# Altium schematic sheet MCU.SchDoc
size A4
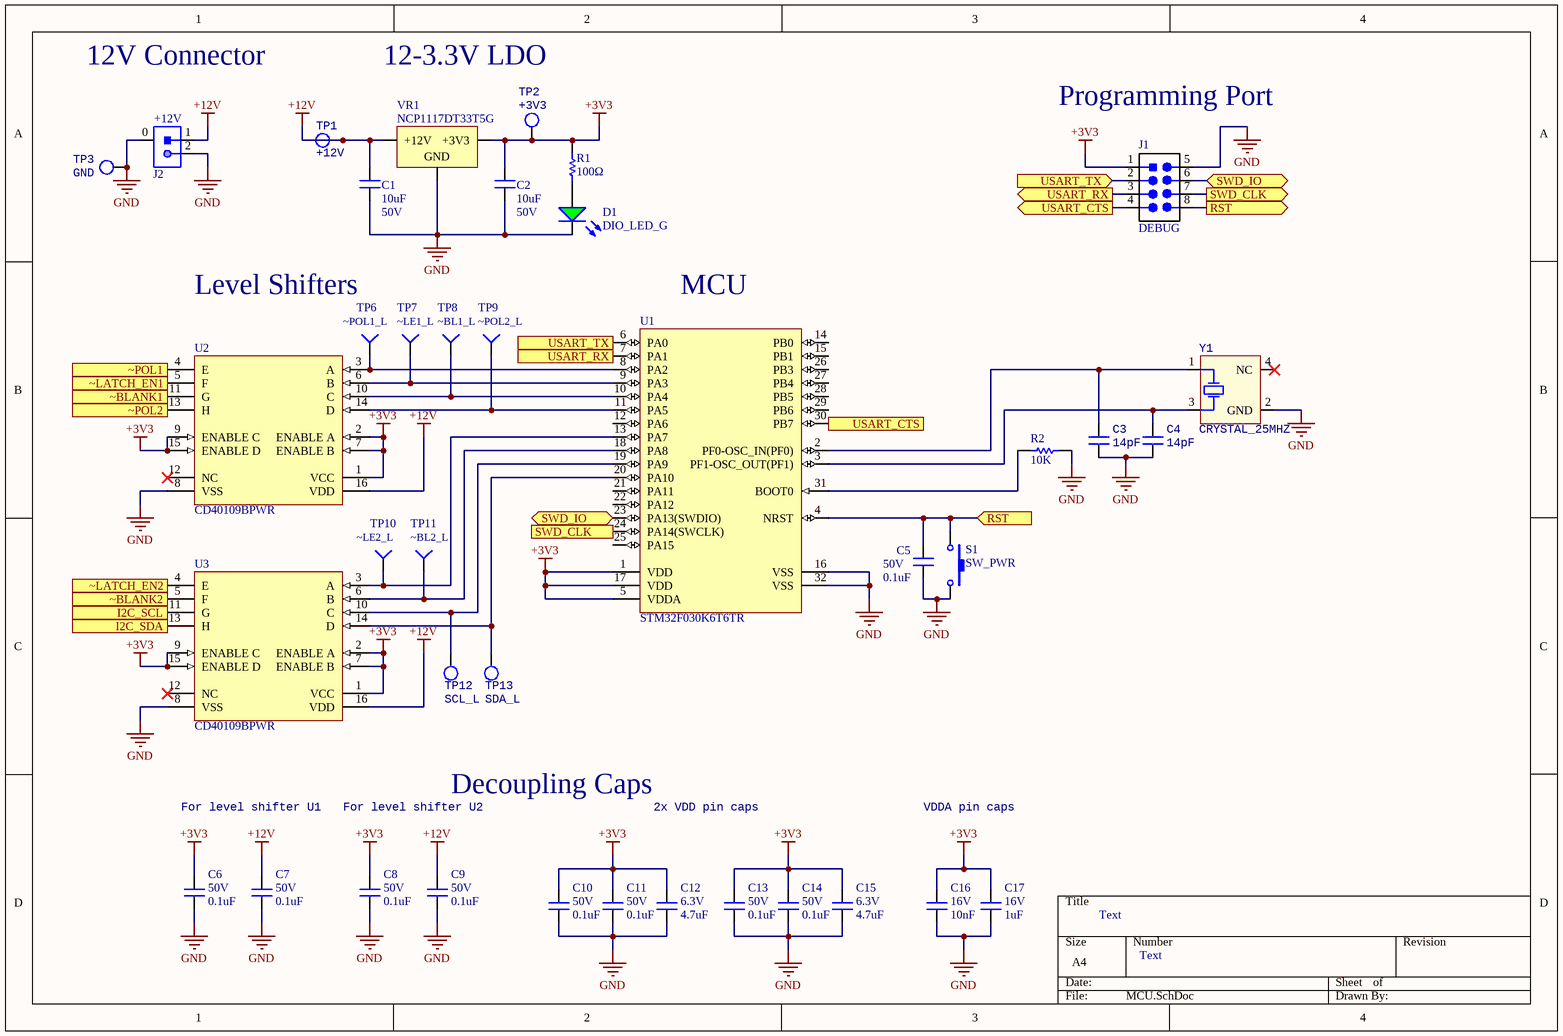
[diagram p0: MCU.SchDoc]

## Parts
C1  Voltage Rating: 50V  [CAPC1206(3216)]  (hidden comment: 10uF)
C2  Voltage Rating: 50V  [CAPC1206(3216)]  (hidden comment: 10uF)
C3  value 14pF  [CAPC0603(1608)55_N]  (hidden comment: CAP_14pF_50V_0603)
C4  value 14pF  (hidden comment: *)
C5  value 0.1uF  Voltage Rating: 50V  [CAPC0603(1608)55_N]  (hidden comment: CAP_0.1uF_50V_0603)
C6  value 0.1uF  Voltage Rating: 50V  [CAPC0603(1608)55_N]  (hidden comment: CAP_0.1uF_50V_0603)
C7  value 0.1uF  Voltage Rating: 50V  [CAPC0603(1608)55_N]  (hidden comment: CAP_0.1uF_50V_0603)
C8  value 0.1uF  Voltage Rating: 50V  [CAPC0603(1608)55_N]  (hidden comment: CAP_0.1uF_50V_0603)
C9  value 0.1uF  Voltage Rating: 50V  [CAPC0603(1608)55_N]  (hidden comment: CAP_0.1uF_50V_0603)
C10  value 0.1uF  Voltage Rating: 50V  [CAPC0603(1608)55_N]  (hidden comment: CAP_0.1uF_50V_0603)
C11  value 0.1uF  Voltage Rating: 50V  [CAPC0603(1608)55_N]  (hidden comment: CAP_0.1uF_50V_0603)
C12  value 4.7uF  Voltage Rating: 6.3V  [CAPC0603(1608)55_N]  (hidden comment: CAP_4.7uF_0603)
C13  value 0.1uF  Voltage Rating: 50V  [CAPC0603(1608)55_N]  (hidden comment: CAP_0.1uF_50V_0603)
C14  value 0.1uF  Voltage Rating: 50V  [CAPC0603(1608)55_N]  (hidden comment: CAP_0.1uF_50V_0603)
C15  value 4.7uF  Voltage Rating: 6.3V  [CAPC0603(1608)55_N]  (hidden comment: CAP_4.7uF_0603)
C16  value 10nF  Voltage Rating: 16V  [CAPC0603(1608)55_N]  (hidden comment: CAP_10nF_0603)
C17  value 1uF  Voltage Rating: 16V  [CAPC0603(1608)55_N]  (hidden comment: CAP_1uF_16V_0603)
D1  DIO_LED_G  [LED_0805_LINE]
J1  DEBUG  [HEADER_2X4]
J2  +12V  [MOLEX-5024940270]
R1  value 100Ω  [RESC0603(1608)_N]  (hidden comment: RES_100Ω_0603)
R2  value 10K  [RESC0603(1608)_N]  (hidden comment: RES_10K_0603)
S1  SW_PWR  [PTS830GM140]
TP1  +12V  [TESTPOINT_LOOP]
TP2  +3V3  [TESTPOINT_LOOP]
TP3  GND  [TESTPOINT_LOOP]
TP6  ~POL1_L  [TESTPOINT]
TP7  ~LE1_L  [TESTPOINT]
TP8  ~BL1_L  [TESTPOINT]
TP9  ~POL2_L  [TESTPOINT]
TP10  ~LE2_L  [TESTPOINT]
TP11  ~BL2_L  [TESTPOINT]
TP12  SCL_L  [TESTPOINT_LOOP]
TP13  SDA_L  [TESTPOINT_LOOP]
U1  STM32F030K6T6TR  [STM-LQFP32_M]
U2  CD40109BPWR  [LVL_SHIFTER_PW0016A_M]
U3  CD40109BPWR  [LVL_SHIFTER_PW0016A_M]
VR1  NCP1117DT33T5G  [VOLTAGE_REGULATOR]
Y1  CRYSTAL_25MHZ  [AVX-CX2520DB32000D0GEJZ1-4_V]

## Ports
I2C_SCL (out), I2C_SDA (out), RST (in), RST (out), SWD_CLK (in), SWD_CLK (out), SWD_IO (bidir), USART_CTS (in), USART_CTS (out), USART_RX (in), USART_RX (out), USART_TX (in), USART_TX (out), ~BLANK1 (out), ~BLANK2 (out), ~LATCH_EN1 (out), ~LATCH_EN2 (out), ~POL1 (out), ~POL2 (out)

## Nets
+3V3: C2.1 C6.2 C8.2 C10.2 C11.2 C12.2 C13.2 C14.2 C15.2 C16.2 C17.2 J1.1(VCC) R1.1 TP2.1 U1.1(VDD) U1.5(VDDA) U1.17(VDD) U2.1(VCC) U2.2(ENABLE_A) U2.7(ENABLE_B) U2.9(ENABLE_C) U2.15(ENABLE_D) U3.1(VCC) U3.2(ENABLE_A) U3.7(ENABLE_B) U3.9(ENABLE_C) U3.15(ENABLE_D) VR1.2(+3V3)
+12V: C1.1 C7.2 C9.2 J2.1 TP1.1 U2.16(VDD) U3.16(VDD) VR1.3(+12V)
GND: C1.2 C2.2 C3.1 C4.1 C5.1 C6.1 C7.1 C8.1 C9.1 C10.1 C11.1 C12.1 C13.1 C14.1 C15.1 C16.1 C17.1 D1.2(K) J1.5(GND) J2.0 J2.2 R2.2 S1.2 TP3.1 U1.16(VSS) U1.32(VSS) U2.8(VSS) U3.8(VSS) VR1.1(GND) Y1.2(GND)
I2C_SCL: U3.11(G) ; port I2C_SCL
I2C_SDA: U3.13(H) ; port I2C_SDA
RST: C5.2 J1.8 S1.1 U1.4(NRST) ; port RST
SWD_CLK: J1.7 U1.24(PA14(SWCLK)) ; port SWD_CLK
SWD_IO: J1.6 U1.23(PA13(SWDIO)) ; port SWD_IO
USART_CTS: J1.4 U1.30(PB7) ; port USART_CTS
USART_RX: J1.3 U1.7(PA1) ; port USART_RX
USART_TX: J1.2 U1.6(PA0) ; port USART_TX
~BLANK1: U2.11(G) ; port ~BLANK1
~BLANK2: U3.5(F) ; port ~BLANK2
~LATCH_EN1: U2.5(F) ; port ~LATCH_EN1
~LATCH_EN2: U3.4(E) ; port ~LATCH_EN2
~POL1: U2.4(E) ; port ~POL1
~POL2: U2.13(H) ; port ~POL2
NetC3_2: C3.2 U1.2(PF0-OSC_IN(PF0)) Y1.1(HOT)
NetC4_2: C4.2 U1.3(PF1-OSC_OUT(PF1)) Y1.3(HOT)
NetD1_1: D1.1(A) R1.2
NetR2_1: R2.1 U1.31(BOOT0)
NetTP6_1: TP6.1(=value) U1.8(PA2) U2.3(A)
NetTP7_1: TP7.1(=value) U1.9(PA3) U2.6(B)
NetTP8_1: TP8.1(=value) U1.10(PA4) U2.10(C)
NetTP9_1: TP9.1(=value) U1.11(PA5) U2.14(D)
NetTP10_1: TP10.1(=value) U1.13(PA7) U3.3(A)
NetTP11_1: TP11.1(=value) U1.18(PA8) U3.6(B)
NetTP12_1: TP12.1 U1.19(PA9) U3.10(C)
NetTP13_1: TP13.1 U1.20(PA10) U3.14(D)

Not connected (* = marked no-connect by the designer): U1 12(PA6) 14(PB0) 15(PB1) 21(PA11) 22(PA12) 25(PA15) 26(PB3) 27(PB4) 28(PB5) 29(PB6); U2 12(NC)*; U3 12(NC)*; Y1 4(NC)*

## Notes on the sheet
- 12V Connector
- 12-3.3V LDO
- Programming Port
- Level Shifters
- (near U1) MCU
- For level shifter U1
- For level shifter U2
- Decoupling Caps
- 2x VDD pin caps
- VDDA pin caps
- Text

## Library data of the parts
C1 C2 = CAP_10uF_50V_1206: CAP CER 10UF 50V X5R 1206; Manufacturer Part Numer 1: GRT31CR61H106KE01L; Manufacturer 1: Murata; Dimensions: 0.126" L x 0.063" W (3.20mm x 1.6mm); Package: 1206 (3216 Metric); Supplier Part Number 1: 490-12456-1-ND; Supplier 1: Digi-Key; Mount: Surface Mount; Value: 10uF
C3 C4 = CAP_14pF_50V_0603: CAP CER 14PF 50V C0G/NP0 0603; Manufacturer 1: Samsung; Manufacturer Part Number 1: CL10C140JB8NNNC; Tolerance: 5%; Dielectric: C0G; Supplier 1: Digi-Key; Stock 1: 187088; Pricing 1: 1=0.10000, 10=0.06700, 100=0.02980, 500=0.02130, 1000=0.01673 (USD); RoHS: Yes; Mount: Surface Mount; Case/Package: 0603; Case Code (Metric): 1608; Case Code (Imperial): 0603; Min Operating Temperature: -55°C; Max Operating Temperature: 125°C; Package Quantity: 1; Packaging: Tape and Reel; Voltage Rating: 50V; Voltage Rating (DC): 50V; Length: 1.6mm; Height: 0.8mm; Width: 0.031inch; Depth: 0.8mm; Thickness: 0.035inch; Radiation Hardening: No; ComponentLink1URL: https://datasheet.ciiva.com/25782/cl10c140jb8nnnc-25782947.pdf?src-supplier=Digi-Key; ComponentLink1Description: https://datasheet.ciiva.com/25782/cl10c140jb8nnnc-25782947.pdf?src-supplier=Digi-Key; Supplier Part Number 1: 1276-2187-1-ND; Capacitance: 14pF
C5-C11 C13 C14 = CAP_0.1uF_50V_0603: CAP CER 0.1UF 50V X7R 0603; Manufacturer Part Number 1: CC0603KRX7R9BB104; Manufacturer 1: Yageo; Dimensions: 0.063" L x 0.031" W (1.60mm x 0.80mm); Package: 0603 (1608 Metric); Temperature Coefficient: X7R; Supplier Part Number 1: 311-1344-1-ND; Supplier 1: Digi-Key; Mount: Surface Mount
C12 C15 = CAP_4.7uF_0603: CAP CER 4.7UF 6.3V X5R 0603; Manufacturer Part Number 1: CC0603KRX5R5BB475; Manufacturer 1: Yageo; Dimensions: 0.063" L x 0.031" W (1.60mm x 0.80mm); Package: 0603 (1608 Metric); Temperature Coefficient: X5R; Supplier Part Number 1: 311-1521-1-ND; Supplier 1: Digi-Key; Mount: Surface Mount
C16 = CAP_10nF_0603: CAP CER 10000PF 16V X7R 0603; Manufacturer Part Number 1: CC0603KRX7R7BB103; Manufacturer 1: Yageo; Dimensions: 0.063" L x 0.031" W (1.60mm x 0.80mm); Package: 0603 (1608 Metric); Temperature Coefficient: X7R; Supplier Part Number 1: 311-3369-1-ND; Supplier 1: Digi-Key; Mount: Surface Mount
C17 = CAP_1uF_16V_0603: CAP CER 1UF 16V Y5V 0603; Manufacturer Part Number: CC0603ZRY5V7BB105; Manufacturer 1: Yageo; Dimensions: 0.063" L x 0.031" W (1.60mm x 0.80mm); Package: 0603 (1608 Metric); Temperature Coefficient: Y5V; Supplier Part Number 1: 311-1372-1-ND; Supplier 1: Digi-Key; Mount: Surface Mount
D1 = DIO_LED_G: LED GREEN DIFFUSED 0805 SMD; Manufacturer Part Number 1: LG R971-KN-1; Manufacturer 1: OSRAM; Forward Voltage Drop: 2.2V; Package: 0805 (2012 Metric); Supplier Part Number 1: 475-1410-1-ND; Supplier 1: Digi-Key; Mount: Surface Mount
J1 = HEADER 4X2: CONN HEADER VERT 8POS 2.54MM; Manufacturer Part Number 1: M20-9980445; Manufacturer 1: Harwin Inc.; Supplier Part Number 1: 952-2122-ND; Supplier 1: Digi-Key; Mount: Through Hole
J2 = CON_2M_SM_RA: CONN HEADER SMD RIGHT ANGLE 2MM PITCH; Manufacturer 1: Molex; Manufacturer Part Number 1: 5024940270; Connector Type: Receptacle,Forked; Number of Positions: 2; Supplier 1: Digi-Key; Stock 1: 3397; Pricing 1: 1=0.53000, 10=0.49400, 25=0.44440, 50=0.39500, 100=0.37850, 250=0.34556 (USD); RoHS: No; Mount: Surface Mount; Contact Plating: Tin; Insulation Color: Natural; Insulation Material: Resin; Min Operating Temperature: -40°C; Max Operating Temperature: 105°C; Fastening Type: Latch; Packaging: Tape and Reel; Number of Rows: 1; Termination: Solder; Flammability Rating: UL94 V-0; ComponentLink1URL: https://www.molex.com/pdm_docs/as/AS-502439-002-001.pdf?src-supplier=Digi-Key; ComponentLink1Description: https://www.molex.com/pdm_docs/as/AS-502439-002-001.pdf?src-supplier=Digi-Key; Supplier Part Number 1: WM15810CT-ND
R1 = RES_100Ω_0603: RES SMD 100 OHM 1% 1/10W 0603; Manufacturer 1: Yageo; Manufacturer Part Number 1: RC0603FR-07100RL; Package: 0603 (1608 Metric); Dimensions: 0.063" L x 0.031" W (1.60mm x 0.80mm); Tolerance: 1%; Supplier Part Number 1: 311-100HRCT-ND; Supplier 1: Digi-Key; Mount: Surface Mount
R2 = RES_10K_0603: RES SMD 10K OHM 5% 1/10W 0603; Manufacturer 1: Yageo; Manufacturer Part Number 1: RC0603JR-0710KL; Package: 0603 (1608 Metric); Dimensions: 0.063" L x 0.031" W (1.60mm x 0.80mm); Tolerance: 5%; Supplier Part Number 1: 311-10KGRCT-ND; Supplier 1: Digi-Key; Mount: Surface Mount
S1 = SW_PWR: Power Switch (Red); pin to pad: 2>4; Manufacturer Part Number 1: PTS830GM140 SMTR LFS; Manufacturer 1: C&K; ComponentLink1Description: Datasheet; ComponentLink1URL: https://www.ckswitches.com/media/1478/pts830.pdf; Supplier Part Number 1: CKN10587CT-ND; Supplier 1: Digi-Key; Mount: Surface Mount
TP1-TP3 TP12 TP13 = TESTPOINT_LOOP: Loop testpoint through-hole pad; Manufacturer 1: Keystone Electronics; Manufacturer Part Number 1: 5002; Supplier Part Number 1: 36-5002-ND; Supplier 1: Digi-Key; Mount: Through Hole
TP6-TP11 = TESTPOINT_SMD: Part Number (MPN): *
U1 = STM32F030K6T6TR: STMICROELECTRONICS - STM32F030K6T6TR - ARM-MCU, STM32 Family STM32F0 Series Microcontrollers, ARM Cortex-M0, 32bit, 48 MHz, 32 KB, 4 KB; Memory Type: FLASH; Memory Size: 32KB; Data Bus Width: 32b; Max Frequency: 48MHz; RAM Size: 4KB; Number of ADC Channels: 12; Number of SPI Channels: 1; Operating Supply Voltage: 3.6V; Number of Timers/Counters: 5; Number of PWM Channels: 6; Supplier 1: Digi-Key; Manufacturer 1: STMicroelectronics; Manufacturer Part Number 1: STM32F030K6T6TR; RoHS: No; Category: Microcontrollers; Stock 1: 3095; Pricing 1: 1=1.44000, 10=1.28500, 25=1.21960, 100=1.00190, 250=0.93656, 500=0.82764, 1000=0.65340 (USD); Mount: Surface Mount; Case/Package: LQFP; Number of Pins: 32; Min Operating Temperature: -40°C; Max Operating Temperature: 85°C; Number of I2C Channels: 1; Core Architecture: ARM; Length: 7.2mm; Height: 1.45mm; Width: 7.2mm; Lead Free: Lead Free; ComponentLink1URL: http://www.farnell.com/datasheets/2815810.pdf?src-supplier=Farnell; ComponentLink1Description: http://www.farnell.com/datasheets/2815810.pdf?src-supplier=Farnell; ComponentLink2URL: http://www.st.com/content/ccc/resource/technical/document/datasheet/a4/5d/0b/0e/87/c4/4d/71/DM00088500.pdf/files/DM00088500.pdf/jcr:content/translations/en.DM00088500.pdf?src-supplier=Digi-Key; ComponentLink2Description: http://www.st.com/content/ccc/resource/technical/document/datasheet/a4/5d/0b/0e/87/c4/4d/71/DM00088500.pdf/files/DM00088500.pdf/jcr:content/translations/en.DM00088500.pdf?src-supplier=Digi-Key; ComponentLink3URL: http://www.st.com/content/ccc/resource/technical/document/user_manual/1d/d4/af/64/18/0d/42/2c/DM00111791.pdf/files/DM00111791.pdf/jcr:content/translations/en.DM00111791.pdf?src-supplier=Digi-Key; ComponentLink3Description: http://www.st.com/content/ccc/resource/technical/document/user_manual/1d/d4/af/64/18/0d/42/2c/DM00111791.pdf/files/DM00111791.pdf/jcr:content/translations/en.DM00111791.pdf?src-supplier=Digi-Key; ComponentLink4URL: http://www.farnell.com/datasheets/2815810.pdf?src-supplier=Element14; ComponentLink4Description: http://www.farnell.com/datasheets/2815810.pdf?src-supplier=Element14; ComponentLink5URL: http://www.farnell.com/datasheets/2815810.pdf?src-supplier=Newark; ComponentLink5Description: http://www.farnell.com/datasheets/2815810.pdf?src-supplier=Newark; Supplier Part Number 1: 497-17334-1-ND
U2 U3 = LEVEL_SHIFTER: CMOS Quad Low-to-High Voltage Level Shifter, 3 to 18 V, -55 to 125 degC, 16-Pin TSSOP (PW16), RoHS, Tape and Reel; Manufacturer: Texas Instruments; VSS: 3 to 18 V; Number of Bits: 4; Propagation Delay: 240 ns Max.; ComponentLink1Description: Manufacturer URL; ComponentLink3Description: Package Specification; ComponentLink3URL: http://www.ti.com/lit/ml/mpds361/mpds361.pdf; PackageDescription: 16-Pin Plastic Small Outline Package, Body 5 x 4.4 mm, Pitch 0.65 mm; DatasheetVersion: SCHS099B; Temperature Range: -55 to 125 degC; Mounting Technology: Surface Mount; Packing: Tape and Reel; RoHS: TRUE; Manufacturer Part Number 1: CD40109BPWR; ComponentLink2Description: Datasheet; Number of Outputs: 4; ComponentLink1URL: www.ti.com; Number of Channels: 4; Package Reference: PW0016A; PackageVersion: 4040064-4/G; ComponentLink2URL: http://www.ti.com/lit/ds/symlink/cd40109b.pdf; Supplier Part Number 1: 296-12163-1-ND; Supplier 1: Digi-Key; Manufacturer 1: Texas Instruments
VR1 = 12V0_3V3_LDO: IC REG LINEAR 3.3V 1A DPAK; Manufacturer 1: ON Semiconductor; Manufacturer Part Number 1: NCP1117DT33T5G; Current Output: 1A; Supplier Part Number 1: NCP1117DT33T5GOSCT-ND; Supplier 1: Digi-Key; Mount: Surface Mount
Y1 = CRYSTAL_25MHZ: CRYSTAL 25.0000MHZ 12PF SMD; Manufacturer 1: Kyocera AVX; Manufacturer Part Number 1: CX2520DB25000H0FLJC1; Frequency: 25MHz; ESR (Equivalent Series Resistance): 80R; Frequency Stability: 15ppm; Frequency Tolerance: 10ppm; Supplier 1: Digi-Key; Stock 1: 11741; Pricing 1: 1=0.72000, 10=0.63300, 50=0.59120, 100=0.52250, 500=0.49500, 1000=0.41250 (USD); RoHS: Yes; Mount: Surface Mount; Case/Package: SMD/SMT; Min Operating Temperature: -30°C; Max Operating Temperature: 85°C; Packaging: Tape and Reel; Load Capacitance: 12pF; Length: 0.098inch; Height: 0.022inch; Width: 0.079inch; Ratings: AEC-Q200; ComponentLink1URL: https://media.digikey.com/pdf/Data%20Sheets/AVX%20PDFs/CX2520DB_USY1M-H1-16429-00_Spec.pdf?src-supplier=Digi-Key; ComponentLink1Description: https://media.digikey.com/pdf/Data%20Sheets/AVX%20PDFs/CX2520DB_USY1M-H1-16429-00_Spec.pdf?src-supplier=Digi-Key; Supplier Part Number 1: 1253-1724-1-ND